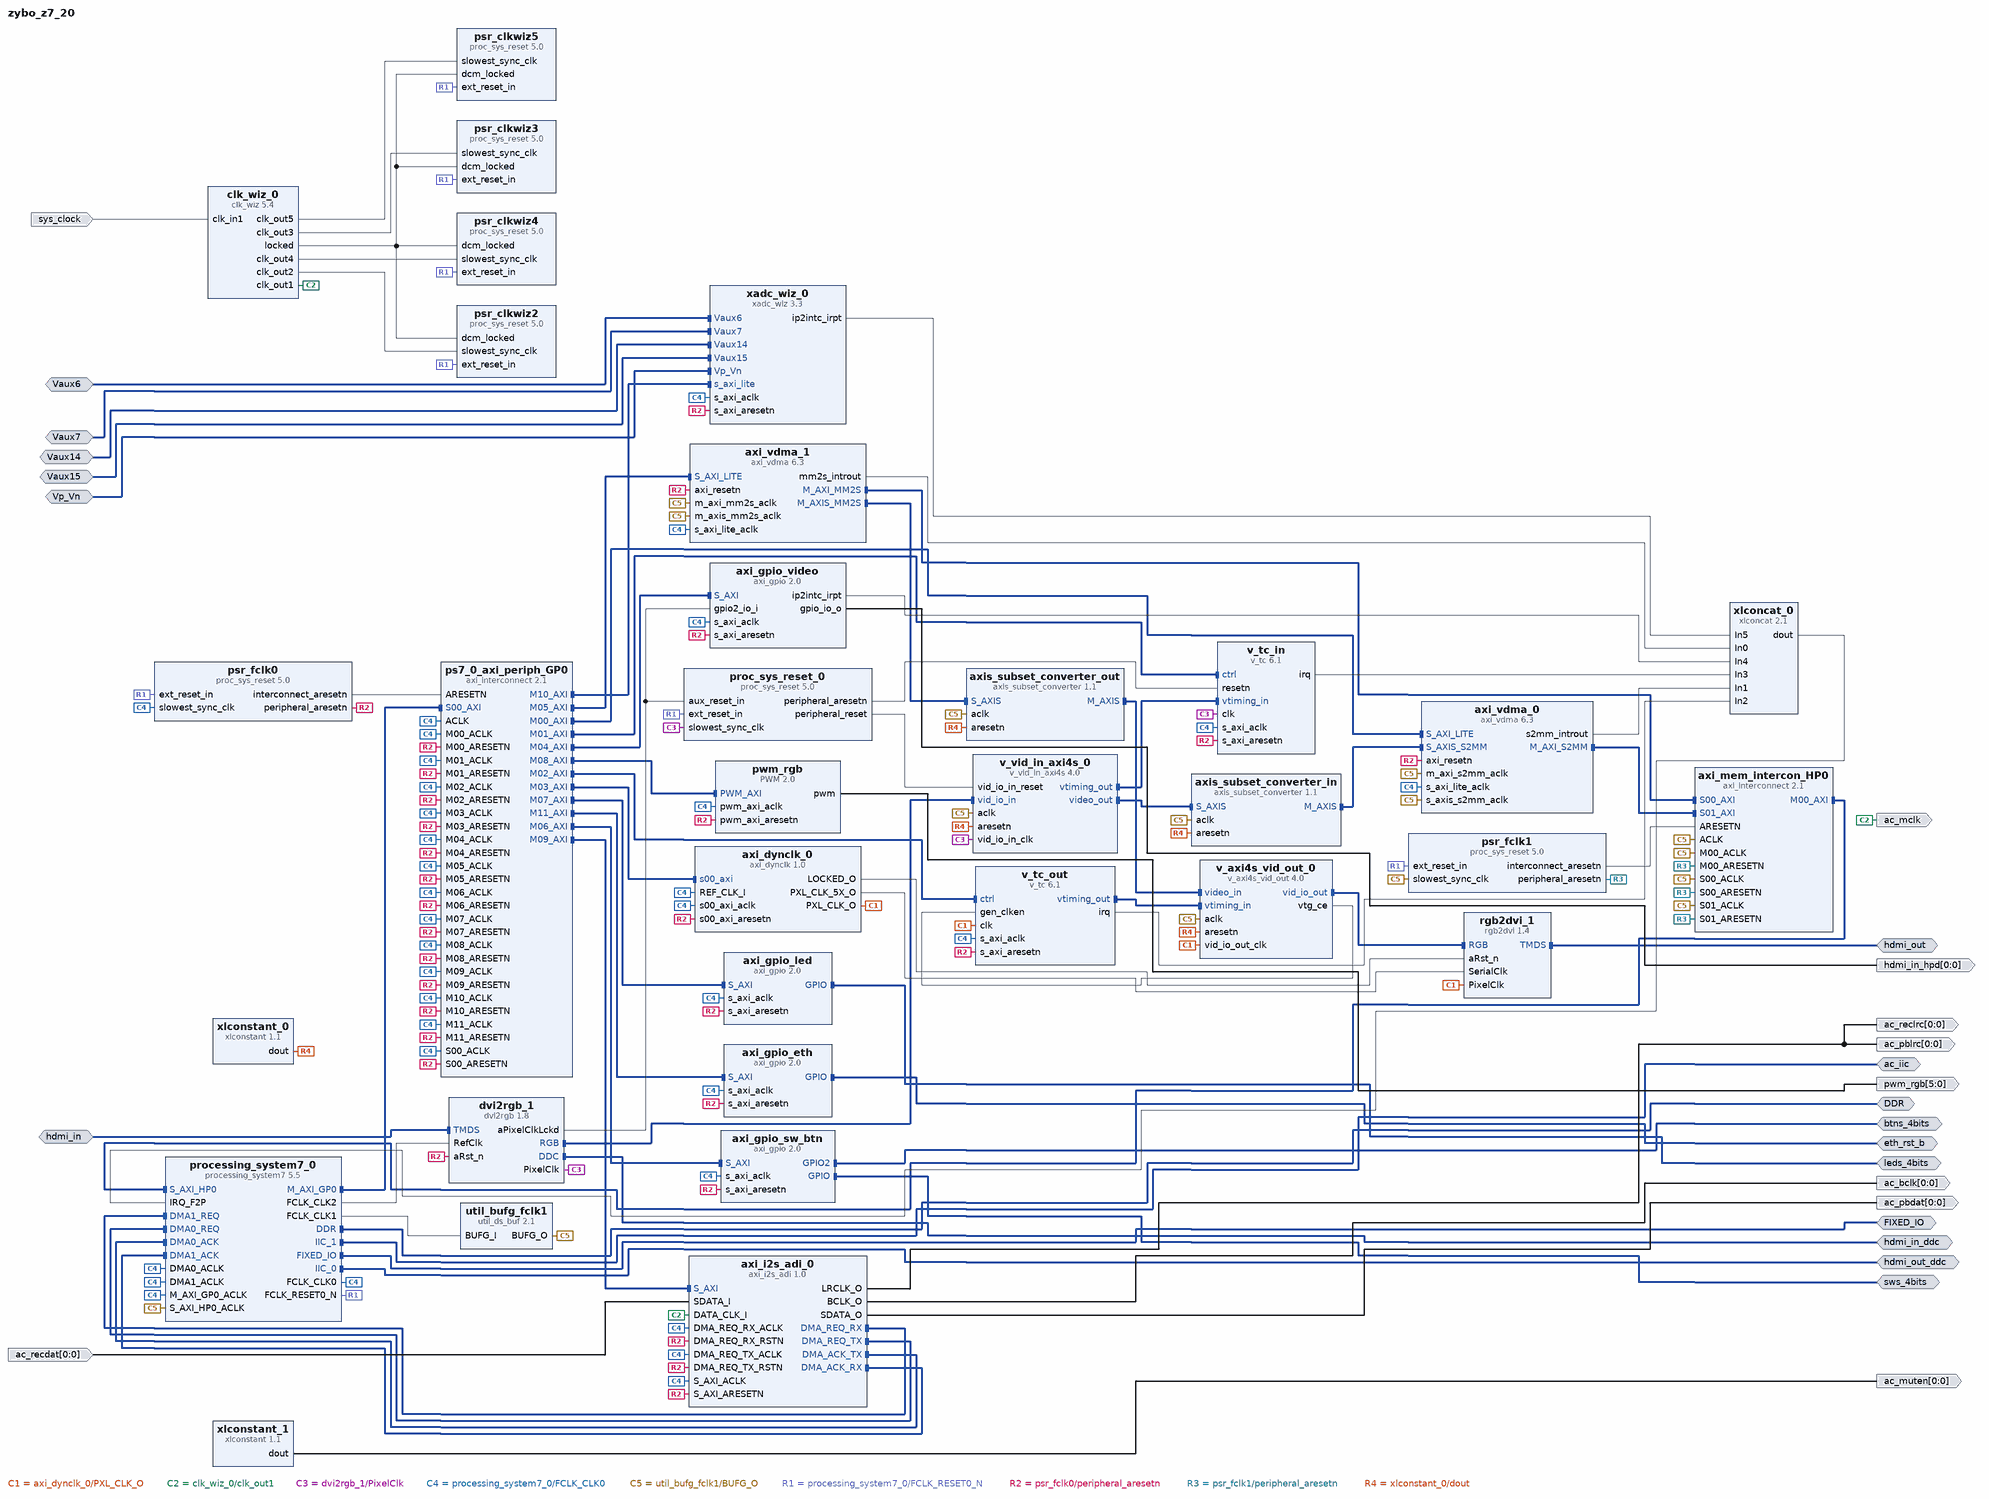
[diagram p0: block diagram of the top level]
# Vivado block design zybo_z7_20, xc7z020clg400-1, Vivado 2017.4
create_bd_design zybo_z7_20

create_bd_intf_port -mode Master -vlnv xilinx.com:interface:ddrx_rtl:1.0 DDR
create_bd_intf_port -mode Master -vlnv xilinx.com:display_processing_system7:fixedio_rtl:1.0 FIXED_IO
create_bd_intf_port -mode Slave -vlnv xilinx.com:interface:diff_analog_io_rtl:1.0 Vaux6
create_bd_intf_port -mode Slave -vlnv xilinx.com:interface:diff_analog_io_rtl:1.0 Vaux7
create_bd_intf_port -mode Slave -vlnv xilinx.com:interface:diff_analog_io_rtl:1.0 Vaux14
create_bd_intf_port -mode Slave -vlnv xilinx.com:interface:diff_analog_io_rtl:1.0 Vaux15
create_bd_intf_port -mode Slave -vlnv xilinx.com:interface:diff_analog_io_rtl:1.0 Vp_Vn
create_bd_intf_port -mode Master -vlnv xilinx.com:interface:iic_rtl:1.0 ac_iic
create_bd_intf_port -mode Master -vlnv xilinx.com:interface:gpio_rtl:1.0 btns_4bits
create_bd_intf_port -mode Master -vlnv xilinx.com:interface:gpio_rtl:1.0 eth_rst_b
create_bd_intf_port -mode Master -vlnv xilinx.com:interface:iic_rtl:1.0 hdmi_out_ddc
create_bd_intf_port -mode Master -vlnv xilinx.com:interface:gpio_rtl:1.0 leds_4bits
create_bd_intf_port -mode Master -vlnv xilinx.com:interface:gpio_rtl:1.0 sws_4bits
create_bd_intf_port -mode Slave -vlnv digilentinc.com:interface:tmds_rtl:1.0 hdmi_in
create_bd_intf_port -mode Master -vlnv xilinx.com:interface:iic_rtl:1.0 hdmi_in_ddc
create_bd_intf_port -mode Master -vlnv digilentinc.com:interface:tmds_rtl:1.0 hdmi_out
create_bd_port -dir O -from 5 -to 0 pwm_rgb
create_bd_port -dir I -from 0 -to 0 ac_recdat
create_bd_port -dir O -from 0 -to 0 hdmi_in_hpd
create_bd_port -dir O -from 0 -to 0 ac_bclk
create_bd_port -dir O -from 0 -to 0 ac_reclrc
create_bd_port -dir O -from 0 -to 0 ac_pblrc
create_bd_port -dir O -from 0 -to 0 ac_pbdat
create_bd_port -dir O -type clk ac_mclk
create_bd_port -dir I -type clk sys_clock
set_property -dict {CONFIG.FREQ_HZ 125000000 CONFIG.PHASE 0.000} [get_bd_ports sys_clock]
create_bd_port -dir O -from 0 -to 0 ac_muten

create_bd_cell -type ip -vlnv digilentinc.com:ip:axi_dynclk:1.0 axi_dynclk_0
create_bd_cell -type ip -vlnv xilinx.com:ip:axi_gpio:2.0 axi_gpio_eth
set_property -dict [list \
  CONFIG.C_TRI_DEFAULT 0xFFFFFFFF \
  CONFIG.C_GPIO_WIDTH 1 \
  CONFIG.C_DOUT_DEFAULT 0x00000000 \
] [get_bd_cells axi_gpio_eth]
create_bd_cell -type ip -vlnv xilinx.com:ip:axi_gpio:2.0 axi_gpio_led
set_property -dict {CONFIG.USE_BOARD_FLOW true CONFIG.GPIO_BOARD_INTERFACE leds_4bits} [get_bd_cells axi_gpio_led]
create_bd_cell -type ip -vlnv xilinx.com:ip:axi_gpio:2.0 axi_gpio_sw_btn
set_property -dict [list \
  CONFIG.USE_BOARD_FLOW true \
  CONFIG.GPIO_BOARD_INTERFACE sws_4bits \
  CONFIG.GPIO2_BOARD_INTERFACE btns_4bits \
] [get_bd_cells axi_gpio_sw_btn]
create_bd_cell -type ip -vlnv xilinx.com:ip:axi_gpio:2.0 axi_gpio_video
set_property -dict [list \
  CONFIG.C_GPIO_WIDTH 1 \
  CONFIG.C_GPIO2_WIDTH 1 \
  CONFIG.C_IS_DUAL 1 \
  CONFIG.C_ALL_INPUTS_2 1 \
  CONFIG.C_INTERRUPT_PRESENT 1 \
  CONFIG.C_ALL_OUTPUTS 1 \
] [get_bd_cells axi_gpio_video]
create_bd_cell -type ip -vlnv analog.com:user:axi_i2s_adi:1.0 axi_i2s_adi_0
set_property -dict {CONFIG.C_DMA_TYPE 1 CONFIG.C_S_AXI_ADDR_WIDTH 32} [get_bd_cells axi_i2s_adi_0]
create_bd_cell -type ip -vlnv xilinx.com:ip:axi_interconnect:2.1 axi_mem_intercon_HP0
set_property -dict [list \
  CONFIG.NUM_SI 2 \
  CONFIG.NUM_MI 1 \
  CONFIG.ENABLE_ADVANCED_OPTIONS 1 \
  CONFIG.XBAR_DATA_WIDTH 64 \
  CONFIG.SYNCHRONIZATION_STAGES 2 \
  CONFIG.M00_HAS_REGSLICE 4 \
  CONFIG.S00_HAS_REGSLICE 4 \
  CONFIG.S01_HAS_REGSLICE 4 \
] [get_bd_cells axi_mem_intercon_HP0]
create_bd_cell -type ip -vlnv xilinx.com:ip:axi_vdma:6.3 axi_vdma_0
set_property -dict [list \
  CONFIG.c_m_axi_s2mm_data_width 64 \
  CONFIG.c_include_s2mm_dre 1 \
  CONFIG.c_num_fstores 1 \
  CONFIG.c_s2mm_linebuffer_depth 2048 \
  CONFIG.c_include_mm2s 0 \
  CONFIG.c_s2mm_max_burst_length 32 \
] [get_bd_cells axi_vdma_0]
create_bd_cell -type ip -vlnv xilinx.com:ip:axi_vdma:6.3 axi_vdma_1
set_property -dict [list \
  CONFIG.c_m_axis_mm2s_tdata_width 24 \
  CONFIG.c_num_fstores 1 \
  CONFIG.c_mm2s_linebuffer_depth 2048 \
  CONFIG.c_mm2s_max_burst_length 32 \
  CONFIG.c_include_s2mm 0 \
  CONFIG.c_include_mm2s_dre 1 \
] [get_bd_cells axi_vdma_1]
create_bd_cell -type ip -vlnv xilinx.com:ip:axis_subset_converter:1.1 axis_subset_converter_in
set_property -dict [list \
  CONFIG.S_TDATA_NUM_BYTES 3 \
  CONFIG.M_TDATA_NUM_BYTES 3 \
  CONFIG.S_TUSER_WIDTH 1 \
  CONFIG.M_TUSER_WIDTH 1 \
  CONFIG.S_HAS_TLAST 1 \
  CONFIG.M_HAS_TLAST 1 \
  CONFIG.TDATA_REMAP {tdata[23:16],tdata[7:0],tdata[15:8]} \
  CONFIG.TUSER_REMAP {tuser[0:0]} \
  CONFIG.TLAST_REMAP {tlast[0]} \
] [get_bd_cells axis_subset_converter_in]
create_bd_cell -type ip -vlnv xilinx.com:ip:axis_subset_converter:1.1 axis_subset_converter_out
set_property -dict [list \
  CONFIG.S_TDATA_NUM_BYTES 3 \
  CONFIG.M_TDATA_NUM_BYTES 3 \
  CONFIG.S_TUSER_WIDTH 1 \
  CONFIG.M_TUSER_WIDTH 1 \
  CONFIG.S_HAS_TLAST 1 \
  CONFIG.M_HAS_TLAST 1 \
  CONFIG.TDATA_REMAP {tdata[23:16],tdata[7:0],tdata[15:8]} \
  CONFIG.TUSER_REMAP {tuser[0:0]} \
  CONFIG.TLAST_REMAP {tlast[0]} \
] [get_bd_cells axis_subset_converter_out]
create_bd_cell -type ip -vlnv xilinx.com:ip:clk_wiz:5.4 clk_wiz_0
set_property -dict [list \
  CONFIG.PRIMITIVE PLL \
  CONFIG.CLKIN1_JITTER_PS 80.0 \
  CONFIG.CLKOUT2_USED true \
  CONFIG.CLKOUT3_USED true \
  CONFIG.CLKOUT4_USED true \
  CONFIG.CLKOUT5_USED true \
  CONFIG.NUM_OUT_CLKS 5 \
  CONFIG.CLKOUT1_REQUESTED_OUT_FREQ 12.000 \
  CONFIG.CLKOUT2_REQUESTED_OUT_FREQ 150 \
  CONFIG.CLKOUT3_REQUESTED_OUT_FREQ 115 \
  CONFIG.CLKOUT4_REQUESTED_OUT_FREQ 75 \
  CONFIG.CLKOUT5_REQUESTED_OUT_FREQ 50 \
  CONFIG.CLKOUT1_DRIVES BUFG \
  CONFIG.CLKOUT2_DRIVES BUFG \
  CONFIG.CLKOUT3_DRIVES BUFG \
  CONFIG.CLKOUT4_DRIVES BUFG \
  CONFIG.CLKOUT5_DRIVES BUFG \
  CONFIG.CLKOUT6_DRIVES BUFG \
  CONFIG.CLKOUT7_DRIVES BUFG \
  CONFIG.USE_LOCKED true \
  CONFIG.USE_RESET false \
  CONFIG.MMCM_DIVCLK_DIVIDE 1 \
  CONFIG.MMCM_CLKFBOUT_MULT_F 12 \
  CONFIG.MMCM_CLKIN1_PERIOD 8.000 \
  CONFIG.MMCM_CLKIN2_PERIOD 10.000 \
  CONFIG.MMCM_COMPENSATION ZHOLD \
  CONFIG.MMCM_CLKOUT0_DIVIDE_F 125 \
  CONFIG.MMCM_CLKOUT1_DIVIDE 10 \
  CONFIG.MMCM_CLKOUT2_DIVIDE 13 \
  CONFIG.MMCM_CLKOUT3_DIVIDE 20 \
  CONFIG.MMCM_CLKOUT4_DIVIDE 30 \
  CONFIG.USE_BOARD_FLOW true \
  CONFIG.CLK_IN1_BOARD_INTERFACE sys_clock \
  CONFIG.CLKOUT1_JITTER 142.005 \
  CONFIG.CLKOUT1_PHASE_ERROR 73.940 \
  CONFIG.CLKOUT2_JITTER 88.814 \
  CONFIG.CLKOUT2_PHASE_ERROR 73.940 \
  CONFIG.CLKOUT3_JITTER 93.189 \
  CONFIG.CLKOUT3_PHASE_ERROR 73.940 \
  CONFIG.CLKOUT4_JITTER 100.871 \
  CONFIG.CLKOUT4_PHASE_ERROR 73.940 \
  CONFIG.CLKOUT5_JITTER 108.704 \
  CONFIG.CLKOUT5_PHASE_ERROR 73.940 \
] [get_bd_cells clk_wiz_0]
create_bd_cell -type ip -vlnv digilentinc.com:ip:dvi2rgb:1.8 dvi2rgb_1
set_property -dict [list \
  CONFIG.kRstActiveHigh false \
  CONFIG.kClkRange 2 \
  CONFIG.kAddBUFG true \
  CONFIG.kEdidFileName dgl_720p_cea.data \
  CONFIG.TMDS_BOARD_INTERFACE Custom \
  CONFIG.IIC_BOARD_INTERFACE Custom \
] [get_bd_cells dvi2rgb_1]
create_bd_cell -type ip -vlnv xilinx.com:ip:proc_sys_reset:5.0 proc_sys_reset_0
create_bd_cell -type ip -vlnv xilinx.com:ip:processing_system7:5.5 processing_system7_0
set_property -dict [list \
  CONFIG.PCW_UIPARAM_DDR_FREQ_MHZ 533.333333 \
  CONFIG.PCW_APU_PERIPHERAL_FREQMHZ 667 \
  CONFIG.PCW_SDIO_PERIPHERAL_FREQMHZ 50 \
  CONFIG.PCW_UART_PERIPHERAL_FREQMHZ 100 \
  CONFIG.PCW_I2C_PERIPHERAL_FREQMHZ 111.111115 \
  CONFIG.PCW_FPGA0_PERIPHERAL_FREQMHZ 100 \
  CONFIG.PCW_FPGA1_PERIPHERAL_FREQMHZ 133 \
  CONFIG.PCW_FPGA2_PERIPHERAL_FREQMHZ 200 \
  CONFIG.PCW_FPGA3_PERIPHERAL_FREQMHZ 75 \
  CONFIG.PCW_USE_S_AXI_HP0 1 \
  CONFIG.PCW_USE_DMA0 1 \
  CONFIG.PCW_USE_DMA1 1 \
  CONFIG.PCW_USE_FABRIC_INTERRUPT 1 \
  CONFIG.PCW_EN_CLK1_PORT 1 \
  CONFIG.PCW_EN_CLK2_PORT 1 \
  CONFIG.PCW_IRQ_F2P_INTR 1 \
  CONFIG.PCW_GP0_EN_MODIFIABLE_TXN 0 \
  CONFIG.PCW_GP1_EN_MODIFIABLE_TXN 0 \
  CONFIG.PCW_PERIPHERAL_BOARD_PRESET part0 \
  CONFIG.PCW_PRESET_BANK1_VOLTAGE {LVCMOS 1.8V} \
  CONFIG.PCW_UIPARAM_DDR_MEMORY_TYPE {DDR 3 (Low Voltage)} \
  CONFIG.PCW_UIPARAM_DDR_PARTNO {MT41K256M16 RE-125} \
  CONFIG.PCW_QSPI_PERIPHERAL_ENABLE 1 \
  CONFIG.PCW_QSPI_QSPI_IO {MIO 1 .. 6} \
  CONFIG.PCW_QSPI_GRP_SINGLE_SS_ENABLE 1 \
  CONFIG.PCW_QSPI_GRP_SINGLE_SS_IO {MIO 1 .. 6} \
  CONFIG.PCW_SINGLE_QSPI_DATA_MODE x4 \
  CONFIG.PCW_QSPI_GRP_FBCLK_ENABLE 1 \
  CONFIG.PCW_QSPI_GRP_FBCLK_IO {MIO 8} \
  CONFIG.PCW_ENET0_PERIPHERAL_ENABLE 1 \
  CONFIG.PCW_ENET0_ENET0_IO {MIO 16 .. 27} \
  CONFIG.PCW_ENET0_GRP_MDIO_ENABLE 1 \
  CONFIG.PCW_ENET0_GRP_MDIO_IO {MIO 52 .. 53} \
  CONFIG.PCW_ENET_RESET_ENABLE 1 \
  CONFIG.PCW_ENET_RESET_SELECT {Share reset pin} \
  CONFIG.PCW_ENET0_RESET_ENABLE 0 \
  CONFIG.PCW_SD0_PERIPHERAL_ENABLE 1 \
  CONFIG.PCW_SD0_SD0_IO {MIO 40 .. 45} \
  CONFIG.PCW_SD0_GRP_CD_ENABLE 1 \
  CONFIG.PCW_SD0_GRP_CD_IO {MIO 47} \
  CONFIG.PCW_SD0_GRP_WP_ENABLE 0 \
  CONFIG.PCW_UART1_PERIPHERAL_ENABLE 1 \
  CONFIG.PCW_UART1_UART1_IO {MIO 48 .. 49} \
  CONFIG.PCW_TTC0_PERIPHERAL_ENABLE 1 \
  CONFIG.PCW_TTC0_TTC0_IO EMIO \
  CONFIG.PCW_USB0_PERIPHERAL_ENABLE 1 \
  CONFIG.PCW_USB0_USB0_IO {MIO 28 .. 39} \
  CONFIG.PCW_USB_RESET_ENABLE 1 \
  CONFIG.PCW_USB_RESET_SELECT {Share reset pin} \
  CONFIG.PCW_USB0_RESET_ENABLE 1 \
  CONFIG.PCW_USB0_RESET_IO {MIO 46} \
  CONFIG.PCW_I2C0_PERIPHERAL_ENABLE 1 \
  CONFIG.PCW_I2C0_I2C0_IO EMIO \
  CONFIG.PCW_I2C1_PERIPHERAL_ENABLE 1 \
  CONFIG.PCW_I2C1_I2C1_IO EMIO \
  CONFIG.PCW_I2C_RESET_ENABLE 1 \
  CONFIG.PCW_I2C_RESET_SELECT {Share reset pin} \
  CONFIG.PCW_GPIO_MIO_GPIO_ENABLE 1 \
  CONFIG.PCW_GPIO_MIO_GPIO_IO MIO \
  CONFIG.PCW_FCLK1_PERIPHERAL_CLKSRC {ARM PLL} \
  CONFIG.PCW_FPGA_FCLK1_ENABLE 1 \
  CONFIG.PCW_FPGA_FCLK2_ENABLE 1 \
] [get_bd_cells processing_system7_0]
# 518 more settings of processing_system7_0 are not shown: defaults, MIO pin electricals, DDR timing, and values the tool derives
create_bd_cell -type ip -vlnv xilinx.com:ip:axi_interconnect:2.1 ps7_0_axi_periph_GP0
set_property -dict {CONFIG.NUM_MI 12 CONFIG.SYNCHRONIZATION_STAGES 2} [get_bd_cells ps7_0_axi_periph_GP0]
create_bd_cell -type ip -vlnv digilentinc.com:IP:PWM:2.0 pwm_rgb
set_property -dict {CONFIG.NUM_PWM 6} [get_bd_cells pwm_rgb]
create_bd_cell -type ip -vlnv digilentinc.com:ip:rgb2dvi:1.4 rgb2dvi_1
set_property -dict [list \
  CONFIG.kRstActiveHigh false \
  CONFIG.kGenerateSerialClk false \
  CONFIG.TMDS_BOARD_INTERFACE Custom \
] [get_bd_cells rgb2dvi_1]
create_bd_cell -type ip -vlnv xilinx.com:ip:proc_sys_reset:5.0 psr_fclk0
create_bd_cell -type ip -vlnv xilinx.com:ip:proc_sys_reset:5.0 psr_fclk1
create_bd_cell -type ip -vlnv xilinx.com:ip:v_axi4s_vid_out:4.0 v_axi4s_vid_out_0
set_property -dict {CONFIG.C_HAS_ASYNC_CLK 1 CONFIG.C_ADDR_WIDTH 12 CONFIG.C_VTG_MASTER_SLAVE 1} [get_bd_cells v_axi4s_vid_out_0]
create_bd_cell -type ip -vlnv xilinx.com:ip:v_tc:6.1 v_tc_in
set_property -dict [list \
  CONFIG.HAS_INTC_IF true \
  CONFIG.horizontal_blank_detection false \
  CONFIG.enable_generation false \
  CONFIG.vertical_blank_detection false \
] [get_bd_cells v_tc_in]
create_bd_cell -type ip -vlnv xilinx.com:ip:v_tc:6.1 v_tc_out
set_property -dict {CONFIG.enable_detection false} [get_bd_cells v_tc_out]
create_bd_cell -type ip -vlnv xilinx.com:ip:v_vid_in_axi4s:4.0 v_vid_in_axi4s_0
set_property -dict {CONFIG.C_HAS_ASYNC_CLK 1 CONFIG.C_ADDR_WIDTH 12} [get_bd_cells v_vid_in_axi4s_0]
create_bd_cell -type ip -vlnv xilinx.com:ip:xadc_wiz:3.3 xadc_wiz_0
set_property -dict [list \
  CONFIG.INTERFACE_SELECTION Enable_AXI \
  CONFIG.XADC_STARUP_SELECTION channel_sequencer \
  CONFIG.SEQUENCER_MODE Continuous \
  CONFIG.ENABLE_RESET false \
  CONFIG.OT_ALARM false \
  CONFIG.USER_TEMP_ALARM false \
  CONFIG.VCCINT_ALARM false \
  CONFIG.VCCAUX_ALARM false \
  CONFIG.ENABLE_VCCPINT_ALARM false \
  CONFIG.ENABLE_VCCPAUX_ALARM false \
  CONFIG.ENABLE_VCCDDRO_ALARM false \
  CONFIG.SINGLE_CHANNEL_SELECTION TEMPERATURE \
  CONFIG.CHANNEL_AVERAGING 16 \
  CONFIG.EXTERNAL_MUX_CHANNEL VP_VN \
  CONFIG.CHANNEL_ENABLE_CALIBRATION true \
  CONFIG.CHANNEL_ENABLE_TEMPERATURE true \
  CONFIG.CHANNEL_ENABLE_VCCINT true \
  CONFIG.CHANNEL_ENABLE_VCCAUX true \
  CONFIG.CHANNEL_ENABLE_VP_VN false \
  CONFIG.CHANNEL_ENABLE_VREFP true \
  CONFIG.CHANNEL_ENABLE_VREFN true \
  CONFIG.CHANNEL_ENABLE_VBRAM true \
  CONFIG.CHANNEL_ENABLE_VCCPINT true \
  CONFIG.CHANNEL_ENABLE_VCCPAUX true \
  CONFIG.CHANNEL_ENABLE_VCCDDRO true \
  CONFIG.CHANNEL_ENABLE_VAUXP6_VAUXN6 true \
  CONFIG.CHANNEL_ENABLE_VAUXP7_VAUXN7 true \
  CONFIG.CHANNEL_ENABLE_VAUXP14_VAUXN14 true \
  CONFIG.CHANNEL_ENABLE_VAUXP15_VAUXN15 true \
] [get_bd_cells xadc_wiz_0]
create_bd_cell -type ip -vlnv xilinx.com:ip:xlconcat:2.1 xlconcat_0
set_property -dict {CONFIG.NUM_PORTS 6} [get_bd_cells xlconcat_0]
create_bd_cell -type ip -vlnv xilinx.com:ip:xlconstant:1.1 xlconstant_0
create_bd_cell -type ip -vlnv xilinx.com:ip:xlconstant:1.1 xlconstant_1
create_bd_cell -type ip -vlnv xilinx.com:ip:proc_sys_reset:5.0 psr_clkwiz2
create_bd_cell -type ip -vlnv xilinx.com:ip:proc_sys_reset:5.0 psr_clkwiz5
create_bd_cell -type ip -vlnv xilinx.com:ip:proc_sys_reset:5.0 psr_clkwiz4
create_bd_cell -type ip -vlnv xilinx.com:ip:proc_sys_reset:5.0 psr_clkwiz3
create_bd_cell -type ip -vlnv xilinx.com:ip:util_ds_buf:2.1 util_bufg_fclk1
set_property -dict {CONFIG.C_BUF_TYPE BUFG} [get_bd_cells util_bufg_fclk1]

# ---- connections ----

connect_bd_intf_net [get_bd_intf_pins axi_i2s_adi_0/DMA_REQ_RX] [get_bd_intf_pins processing_system7_0/DMA1_REQ]
connect_bd_intf_net [get_bd_intf_pins axi_i2s_adi_0/DMA_REQ_TX] [get_bd_intf_pins processing_system7_0/DMA0_REQ]
connect_bd_intf_net -intf_net axi_mem_intercon_M00_AXI [get_bd_intf_pins axi_mem_intercon_HP0/M00_AXI] [get_bd_intf_pins processing_system7_0/S_AXI_HP0]
connect_bd_intf_net [get_bd_intf_pins axi_mem_intercon_HP0/S01_AXI] [get_bd_intf_pins axi_vdma_0/M_AXI_S2MM]
connect_bd_intf_net [get_bd_intf_pins axi_vdma_1/M_AXIS_MM2S] [get_bd_intf_pins axis_subset_converter_out/S_AXIS]
connect_bd_intf_net [get_bd_intf_pins axi_mem_intercon_HP0/S00_AXI] [get_bd_intf_pins axi_vdma_1/M_AXI_MM2S]
connect_bd_intf_net [get_bd_intf_pins axi_vdma_0/S_AXIS_S2MM] [get_bd_intf_pins axis_subset_converter_in/M_AXIS]
connect_bd_intf_net [get_bd_intf_pins axis_subset_converter_out/M_AXIS] [get_bd_intf_pins v_axi4s_vid_out_0/video_in]
connect_bd_intf_net [get_bd_intf_pins dvi2rgb_1/RGB] [get_bd_intf_pins v_vid_in_axi4s_0/vid_io_in]
connect_bd_intf_net [get_bd_intf_pins axi_i2s_adi_0/DMA_ACK_TX] [get_bd_intf_pins processing_system7_0/DMA0_ACK]
connect_bd_intf_net [get_bd_intf_pins axi_i2s_adi_0/DMA_ACK_RX] [get_bd_intf_pins processing_system7_0/DMA1_ACK]
connect_bd_intf_net [get_bd_intf_pins processing_system7_0/M_AXI_GP0] [get_bd_intf_pins ps7_0_axi_periph_GP0/S00_AXI]
connect_bd_intf_net [get_bd_intf_pins axi_gpio_video/S_AXI] [get_bd_intf_pins ps7_0_axi_periph_GP0/M04_AXI]
connect_bd_intf_net [get_bd_intf_pins axi_vdma_1/S_AXI_LITE] [get_bd_intf_pins ps7_0_axi_periph_GP0/M05_AXI]
connect_bd_intf_net [get_bd_intf_pins axi_gpio_sw_btn/S_AXI] [get_bd_intf_pins ps7_0_axi_periph_GP0/M06_AXI]
connect_bd_intf_net [get_bd_intf_pins axi_gpio_led/S_AXI] [get_bd_intf_pins ps7_0_axi_periph_GP0/M07_AXI]
connect_bd_intf_net [get_bd_intf_pins ps7_0_axi_periph_GP0/M08_AXI] [get_bd_intf_pins pwm_rgb/PWM_AXI]
connect_bd_intf_net [get_bd_intf_pins axi_i2s_adi_0/S_AXI] [get_bd_intf_pins ps7_0_axi_periph_GP0/M09_AXI]
connect_bd_intf_net [get_bd_intf_pins ps7_0_axi_periph_GP0/M10_AXI] [get_bd_intf_pins xadc_wiz_0/s_axi_lite]
connect_bd_intf_net [get_bd_intf_pins axi_gpio_eth/S_AXI] [get_bd_intf_pins ps7_0_axi_periph_GP0/M11_AXI]
connect_bd_intf_net [get_bd_intf_pins axi_vdma_0/S_AXI_LITE] [get_bd_intf_pins ps7_0_axi_periph_GP0/M00_AXI]
connect_bd_intf_net [get_bd_intf_pins ps7_0_axi_periph_GP0/M01_AXI] [get_bd_intf_pins v_tc_in/ctrl]
connect_bd_intf_net [get_bd_intf_pins ps7_0_axi_periph_GP0/M02_AXI] [get_bd_intf_pins v_tc_out/ctrl]
connect_bd_intf_net [get_bd_intf_pins axi_dynclk_0/s00_axi] [get_bd_intf_pins ps7_0_axi_periph_GP0/M03_AXI]
connect_bd_intf_net [get_bd_intf_pins rgb2dvi_1/RGB] [get_bd_intf_pins v_axi4s_vid_out_0/vid_io_out]
connect_bd_intf_net -intf_net v_tc_1_vtiming_out [get_bd_intf_pins v_axi4s_vid_out_0/vtiming_in] [get_bd_intf_pins v_tc_out/vtiming_out]
connect_bd_intf_net [get_bd_intf_pins axis_subset_converter_in/S_AXIS] [get_bd_intf_pins v_vid_in_axi4s_0/video_out]
connect_bd_intf_net [get_bd_intf_pins v_tc_in/vtiming_in] [get_bd_intf_pins v_vid_in_axi4s_0/vtiming_out]
connect_bd_intf_net [get_bd_intf_ports DDR] [get_bd_intf_pins processing_system7_0/DDR]
connect_bd_intf_net [get_bd_intf_ports FIXED_IO] [get_bd_intf_pins processing_system7_0/FIXED_IO]
connect_bd_intf_net -intf_net Vaux6_1 [get_bd_intf_ports Vaux6] [get_bd_intf_pins xadc_wiz_0/Vaux6]
connect_bd_intf_net -intf_net Vaux7_1 [get_bd_intf_ports Vaux7] [get_bd_intf_pins xadc_wiz_0/Vaux7]
connect_bd_intf_net -intf_net Vaux14_1 [get_bd_intf_ports Vaux14] [get_bd_intf_pins xadc_wiz_0/Vaux14]
connect_bd_intf_net -intf_net Vaux15_1 [get_bd_intf_ports Vaux15] [get_bd_intf_pins xadc_wiz_0/Vaux15]
connect_bd_intf_net [get_bd_intf_ports Vp_Vn] [get_bd_intf_pins xadc_wiz_0/Vp_Vn]
connect_bd_intf_net [get_bd_intf_ports ac_iic] [get_bd_intf_pins processing_system7_0/IIC_1]
connect_bd_intf_net -intf_net axi_gpio_0_GPIO2 [get_bd_intf_ports btns_4bits] [get_bd_intf_pins axi_gpio_sw_btn/GPIO2]
connect_bd_intf_net [get_bd_intf_ports eth_rst_b] [get_bd_intf_pins axi_gpio_eth/GPIO]
connect_bd_intf_net [get_bd_intf_ports hdmi_out_ddc] [get_bd_intf_pins processing_system7_0/IIC_0]
connect_bd_intf_net -intf_net axi_gpio_0_GPIO1 [get_bd_intf_ports leds_4bits] [get_bd_intf_pins axi_gpio_led/GPIO]
connect_bd_intf_net -intf_net axi_gpio_0_GPIO [get_bd_intf_ports sws_4bits] [get_bd_intf_pins axi_gpio_sw_btn/GPIO]
connect_bd_intf_net -intf_net TMDS_0_1 [get_bd_intf_ports hdmi_in] [get_bd_intf_pins dvi2rgb_1/TMDS]
connect_bd_intf_net [get_bd_intf_ports hdmi_in_ddc] [get_bd_intf_pins dvi2rgb_1/DDC]
connect_bd_intf_net [get_bd_intf_ports hdmi_out] [get_bd_intf_pins rgb2dvi_1/TMDS]
connect_bd_net -net PWM_0_pwm [get_bd_pins pwm_rgb/pwm] [get_bd_ports pwm_rgb]
connect_bd_net -net SDATA_I_1 [get_bd_ports ac_recdat] [get_bd_pins axi_i2s_adi_0/SDATA_I]
connect_bd_net [get_bd_pins axi_dynclk_0/LOCKED_O] [get_bd_pins rgb2dvi_1/aRst_n]
connect_bd_net [get_bd_pins axi_dynclk_0/PXL_CLK_5X_O] [get_bd_pins rgb2dvi_1/SerialClk]
connect_bd_net [get_bd_pins axi_dynclk_0/PXL_CLK_O] \
  [get_bd_pins rgb2dvi_1/PixelClk] [get_bd_pins v_axi4s_vid_out_0/vid_io_out_clk] [get_bd_pins v_tc_out/clk]
connect_bd_net -net axi_gpio_0_gpio_io_o [get_bd_pins axi_gpio_video/gpio_io_o] [get_bd_ports hdmi_in_hpd]
connect_bd_net -net axi_gpio_0_ip2intc_irpt [get_bd_pins axi_gpio_video/ip2intc_irpt] [get_bd_pins xlconcat_0/In4]
connect_bd_net [get_bd_pins axi_i2s_adi_0/BCLK_O] [get_bd_ports ac_bclk]
connect_bd_net [get_bd_pins axi_i2s_adi_0/LRCLK_O] [get_bd_ports ac_pblrc] [get_bd_ports ac_reclrc]
connect_bd_net [get_bd_pins axi_i2s_adi_0/SDATA_O] [get_bd_ports ac_pbdat]
connect_bd_net [get_bd_pins axi_vdma_0/s2mm_introut] [get_bd_pins xlconcat_0/In1]
connect_bd_net [get_bd_pins axi_vdma_1/mm2s_introut] [get_bd_pins xlconcat_0/In0]
connect_bd_net [get_bd_pins clk_wiz_0/clk_out1] [get_bd_ports ac_mclk] [get_bd_pins axi_i2s_adi_0/DATA_CLK_I]
connect_bd_net [get_bd_pins dvi2rgb_1/PixelClk] \
  [get_bd_pins proc_sys_reset_0/slowest_sync_clk] [get_bd_pins v_tc_in/clk] [get_bd_pins v_vid_in_axi4s_0/vid_io_in_clk]
connect_bd_net [get_bd_pins dvi2rgb_1/aPixelClkLckd] [get_bd_pins axi_gpio_video/gpio2_io_i] [get_bd_pins proc_sys_reset_0/aux_reset_in]
connect_bd_net [get_bd_pins proc_sys_reset_0/peripheral_aresetn] [get_bd_pins v_tc_in/resetn]
connect_bd_net [get_bd_pins proc_sys_reset_0/peripheral_reset] [get_bd_pins v_vid_in_axi4s_0/vid_io_in_reset]
connect_bd_net [get_bd_pins processing_system7_0/FCLK_CLK0] \
  [get_bd_pins axi_dynclk_0/REF_CLK_I] [get_bd_pins axi_dynclk_0/s00_axi_aclk] [get_bd_pins axi_gpio_eth/s_axi_aclk] \
  [get_bd_pins axi_gpio_led/s_axi_aclk] [get_bd_pins axi_gpio_sw_btn/s_axi_aclk] [get_bd_pins axi_gpio_video/s_axi_aclk] \
  [get_bd_pins axi_i2s_adi_0/DMA_REQ_RX_ACLK] [get_bd_pins axi_i2s_adi_0/DMA_REQ_TX_ACLK] \
  [get_bd_pins axi_i2s_adi_0/S_AXI_ACLK] [get_bd_pins axi_vdma_0/s_axi_lite_aclk] [get_bd_pins axi_vdma_1/s_axi_lite_aclk] \
  [get_bd_pins processing_system7_0/DMA0_ACLK] [get_bd_pins processing_system7_0/DMA1_ACLK] \
  [get_bd_pins processing_system7_0/M_AXI_GP0_ACLK] [get_bd_pins pwm_rgb/pwm_axi_aclk] \
  [get_bd_pins psr_fclk0/slowest_sync_clk] [get_bd_pins v_tc_in/s_axi_aclk] [get_bd_pins v_tc_out/s_axi_aclk] \
  [get_bd_pins xadc_wiz_0/s_axi_aclk] [get_bd_pins ps7_0_axi_periph_GP0/ACLK] [get_bd_pins ps7_0_axi_periph_GP0/M00_ACLK] \
  [get_bd_pins ps7_0_axi_periph_GP0/M01_ACLK] [get_bd_pins ps7_0_axi_periph_GP0/M02_ACLK] \
  [get_bd_pins ps7_0_axi_periph_GP0/M03_ACLK] [get_bd_pins ps7_0_axi_periph_GP0/M04_ACLK] \
  [get_bd_pins ps7_0_axi_periph_GP0/M05_ACLK] [get_bd_pins ps7_0_axi_periph_GP0/M06_ACLK] \
  [get_bd_pins ps7_0_axi_periph_GP0/M07_ACLK] [get_bd_pins ps7_0_axi_periph_GP0/M08_ACLK] \
  [get_bd_pins ps7_0_axi_periph_GP0/M09_ACLK] [get_bd_pins ps7_0_axi_periph_GP0/M10_ACLK] \
  [get_bd_pins ps7_0_axi_periph_GP0/M11_ACLK] [get_bd_pins ps7_0_axi_periph_GP0/S00_ACLK]
connect_bd_net -net processing_system7_0_FCLK_CLK1 [get_bd_pins util_bufg_fclk1/BUFG_O] \
  [get_bd_pins axi_vdma_0/m_axi_s2mm_aclk] [get_bd_pins axi_vdma_0/s_axis_s2mm_aclk] [get_bd_pins axi_vdma_1/m_axi_mm2s_aclk] \
  [get_bd_pins axi_vdma_1/m_axis_mm2s_aclk] [get_bd_pins axis_subset_converter_in/aclk] \
  [get_bd_pins axis_subset_converter_out/aclk] [get_bd_pins processing_system7_0/S_AXI_HP0_ACLK] \
  [get_bd_pins psr_fclk1/slowest_sync_clk] [get_bd_pins v_axi4s_vid_out_0/aclk] [get_bd_pins v_vid_in_axi4s_0/aclk] \
  [get_bd_pins axi_mem_intercon_HP0/ACLK] [get_bd_pins axi_mem_intercon_HP0/M00_ACLK] \
  [get_bd_pins axi_mem_intercon_HP0/S00_ACLK] [get_bd_pins axi_mem_intercon_HP0/S01_ACLK]
connect_bd_net [get_bd_pins processing_system7_0/FCLK_CLK2] [get_bd_pins dvi2rgb_1/RefClk]
connect_bd_net [get_bd_pins processing_system7_0/FCLK_RESET0_N] \
  [get_bd_pins proc_sys_reset_0/ext_reset_in] [get_bd_pins psr_fclk0/ext_reset_in] [get_bd_pins psr_fclk1/ext_reset_in] \
  [get_bd_pins psr_clkwiz2/ext_reset_in] [get_bd_pins psr_clkwiz3/ext_reset_in] [get_bd_pins psr_clkwiz4/ext_reset_in] \
  [get_bd_pins psr_clkwiz5/ext_reset_in]
connect_bd_net -net rst_ps7_0_100M_interconnect_aresetn [get_bd_pins psr_fclk0/interconnect_aresetn] [get_bd_pins ps7_0_axi_periph_GP0/ARESETN]
connect_bd_net -net rst_ps7_0_100M_peripheral_aresetn [get_bd_pins psr_fclk0/peripheral_aresetn] \
  [get_bd_pins axi_dynclk_0/s00_axi_aresetn] [get_bd_pins axi_gpio_eth/s_axi_aresetn] \
  [get_bd_pins axi_gpio_led/s_axi_aresetn] [get_bd_pins axi_gpio_sw_btn/s_axi_aresetn] \
  [get_bd_pins axi_gpio_video/s_axi_aresetn] [get_bd_pins axi_i2s_adi_0/DMA_REQ_RX_RSTN] \
  [get_bd_pins axi_i2s_adi_0/DMA_REQ_TX_RSTN] [get_bd_pins axi_i2s_adi_0/S_AXI_ARESETN] [get_bd_pins axi_vdma_0/axi_resetn] \
  [get_bd_pins axi_vdma_1/axi_resetn] [get_bd_pins dvi2rgb_1/aRst_n] [get_bd_pins pwm_rgb/pwm_axi_aresetn] \
  [get_bd_pins v_tc_in/s_axi_aresetn] [get_bd_pins v_tc_out/s_axi_aresetn] [get_bd_pins xadc_wiz_0/s_axi_aresetn] \
  [get_bd_pins ps7_0_axi_periph_GP0/M00_ARESETN] [get_bd_pins ps7_0_axi_periph_GP0/M01_ARESETN] \
  [get_bd_pins ps7_0_axi_periph_GP0/M02_ARESETN] [get_bd_pins ps7_0_axi_periph_GP0/M03_ARESETN] \
  [get_bd_pins ps7_0_axi_periph_GP0/M04_ARESETN] [get_bd_pins ps7_0_axi_periph_GP0/M05_ARESETN] \
  [get_bd_pins ps7_0_axi_periph_GP0/M06_ARESETN] [get_bd_pins ps7_0_axi_periph_GP0/M07_ARESETN] \
  [get_bd_pins ps7_0_axi_periph_GP0/M08_ARESETN] [get_bd_pins ps7_0_axi_periph_GP0/M09_ARESETN] \
  [get_bd_pins ps7_0_axi_periph_GP0/M10_ARESETN] [get_bd_pins ps7_0_axi_periph_GP0/M11_ARESETN] \
  [get_bd_pins ps7_0_axi_periph_GP0/S00_ARESETN]
connect_bd_net -net rst_ps7_0_133M_interconnect_aresetn [get_bd_pins psr_fclk1/interconnect_aresetn] [get_bd_pins axi_mem_intercon_HP0/ARESETN]
connect_bd_net -net rst_ps7_0_133M_peripheral_aresetn [get_bd_pins psr_fclk1/peripheral_aresetn] \
  [get_bd_pins axi_mem_intercon_HP0/M00_ARESETN] [get_bd_pins axi_mem_intercon_HP0/S00_ARESETN] \
  [get_bd_pins axi_mem_intercon_HP0/S01_ARESETN]
connect_bd_net [get_bd_ports sys_clock] [get_bd_pins clk_wiz_0/clk_in1]
connect_bd_net [get_bd_pins v_axi4s_vid_out_0/vtg_ce] [get_bd_pins v_tc_out/gen_clken]
connect_bd_net -net v_tc_1_irq [get_bd_pins v_tc_out/irq] [get_bd_pins xlconcat_0/In2]
connect_bd_net [get_bd_pins v_tc_in/irq] [get_bd_pins xlconcat_0/In3]
connect_bd_net [get_bd_pins xadc_wiz_0/ip2intc_irpt] [get_bd_pins xlconcat_0/In5]
connect_bd_net [get_bd_pins xlconcat_0/dout] [get_bd_pins processing_system7_0/IRQ_F2P]
connect_bd_net [get_bd_pins xlconstant_0/dout] \
  [get_bd_pins axis_subset_converter_in/aresetn] [get_bd_pins axis_subset_converter_out/aresetn] \
  [get_bd_pins v_axi4s_vid_out_0/aresetn] [get_bd_pins v_vid_in_axi4s_0/aresetn]
connect_bd_net [get_bd_pins xlconstant_1/dout] [get_bd_ports ac_muten]
connect_bd_net [get_bd_pins clk_wiz_0/clk_out2] [get_bd_pins psr_clkwiz2/slowest_sync_clk]
connect_bd_net [get_bd_pins clk_wiz_0/locked] \
  [get_bd_pins psr_clkwiz2/dcm_locked] [get_bd_pins psr_clkwiz3/dcm_locked] [get_bd_pins psr_clkwiz4/dcm_locked] \
  [get_bd_pins psr_clkwiz5/dcm_locked]
connect_bd_net [get_bd_pins clk_wiz_0/clk_out3] [get_bd_pins psr_clkwiz3/slowest_sync_clk]
connect_bd_net [get_bd_pins clk_wiz_0/clk_out4] [get_bd_pins psr_clkwiz4/slowest_sync_clk]
connect_bd_net [get_bd_pins clk_wiz_0/clk_out5] [get_bd_pins psr_clkwiz5/slowest_sync_clk]
connect_bd_net [get_bd_pins processing_system7_0/FCLK_CLK1] [get_bd_pins util_bufg_fclk1/BUFG_I]

# ---- address map ----
assign_bd_address -offset 0x00000000 -range 1G -target_address_space [get_bd_addr_spaces axi_vdma_0/Data_S2MM] [get_bd_addr_segs processing_system7_0/S_AXI_HP0/HP0_DDR_LOWOCM]
assign_bd_address -offset 0x00000000 -range 1G -target_address_space [get_bd_addr_spaces axi_vdma_1/Data_MM2S] [get_bd_addr_segs processing_system7_0/S_AXI_HP0/HP0_DDR_LOWOCM]
assign_bd_address -offset 0x41200000 -range 64K -target_address_space [get_bd_addr_spaces processing_system7_0/Data] [get_bd_addr_segs axi_gpio_video/S_AXI/Reg]
assign_bd_address -offset 0x41210000 -range 64K -target_address_space [get_bd_addr_spaces processing_system7_0/Data] [get_bd_addr_segs axi_gpio_sw_btn/S_AXI/Reg]
assign_bd_address -offset 0x41220000 -range 64K -target_address_space [get_bd_addr_spaces processing_system7_0/Data] [get_bd_addr_segs axi_gpio_led/S_AXI/Reg]
assign_bd_address -offset 0x41230000 -range 64K -target_address_space [get_bd_addr_spaces processing_system7_0/Data] [get_bd_addr_segs axi_gpio_eth/S_AXI/Reg]
assign_bd_address -offset 0x43000000 -range 64K -target_address_space [get_bd_addr_spaces processing_system7_0/Data] [get_bd_addr_segs axi_vdma_0/S_AXI_LITE/Reg]
assign_bd_address -offset 0x43010000 -range 64K -target_address_space [get_bd_addr_spaces processing_system7_0/Data] [get_bd_addr_segs axi_vdma_1/S_AXI_LITE/Reg]
assign_bd_address -offset 0x43C00000 -range 64K -target_address_space [get_bd_addr_spaces processing_system7_0/Data] [get_bd_addr_segs v_tc_in/ctrl/Reg]
assign_bd_address -offset 0x43C10000 -range 64K -target_address_space [get_bd_addr_spaces processing_system7_0/Data] [get_bd_addr_segs v_tc_out/ctrl/Reg]
assign_bd_address -offset 0x43C20000 -range 64K -target_address_space [get_bd_addr_spaces processing_system7_0/Data] [get_bd_addr_segs axi_dynclk_0/s00_axi/reg0]
assign_bd_address -offset 0x43C30000 -range 64K -target_address_space [get_bd_addr_spaces processing_system7_0/Data] [get_bd_addr_segs pwm_rgb/PWM_AXI/PWM_AXI_reg]
assign_bd_address -offset 0x43C40000 -range 64K -target_address_space [get_bd_addr_spaces processing_system7_0/Data] [get_bd_addr_segs axi_i2s_adi_0/S_AXI/reg0]
assign_bd_address -offset 0x43C50000 -range 64K -target_address_space [get_bd_addr_spaces processing_system7_0/Data] [get_bd_addr_segs xadc_wiz_0/s_axi_lite/Reg]

validate_bd_design
save_bd_design
